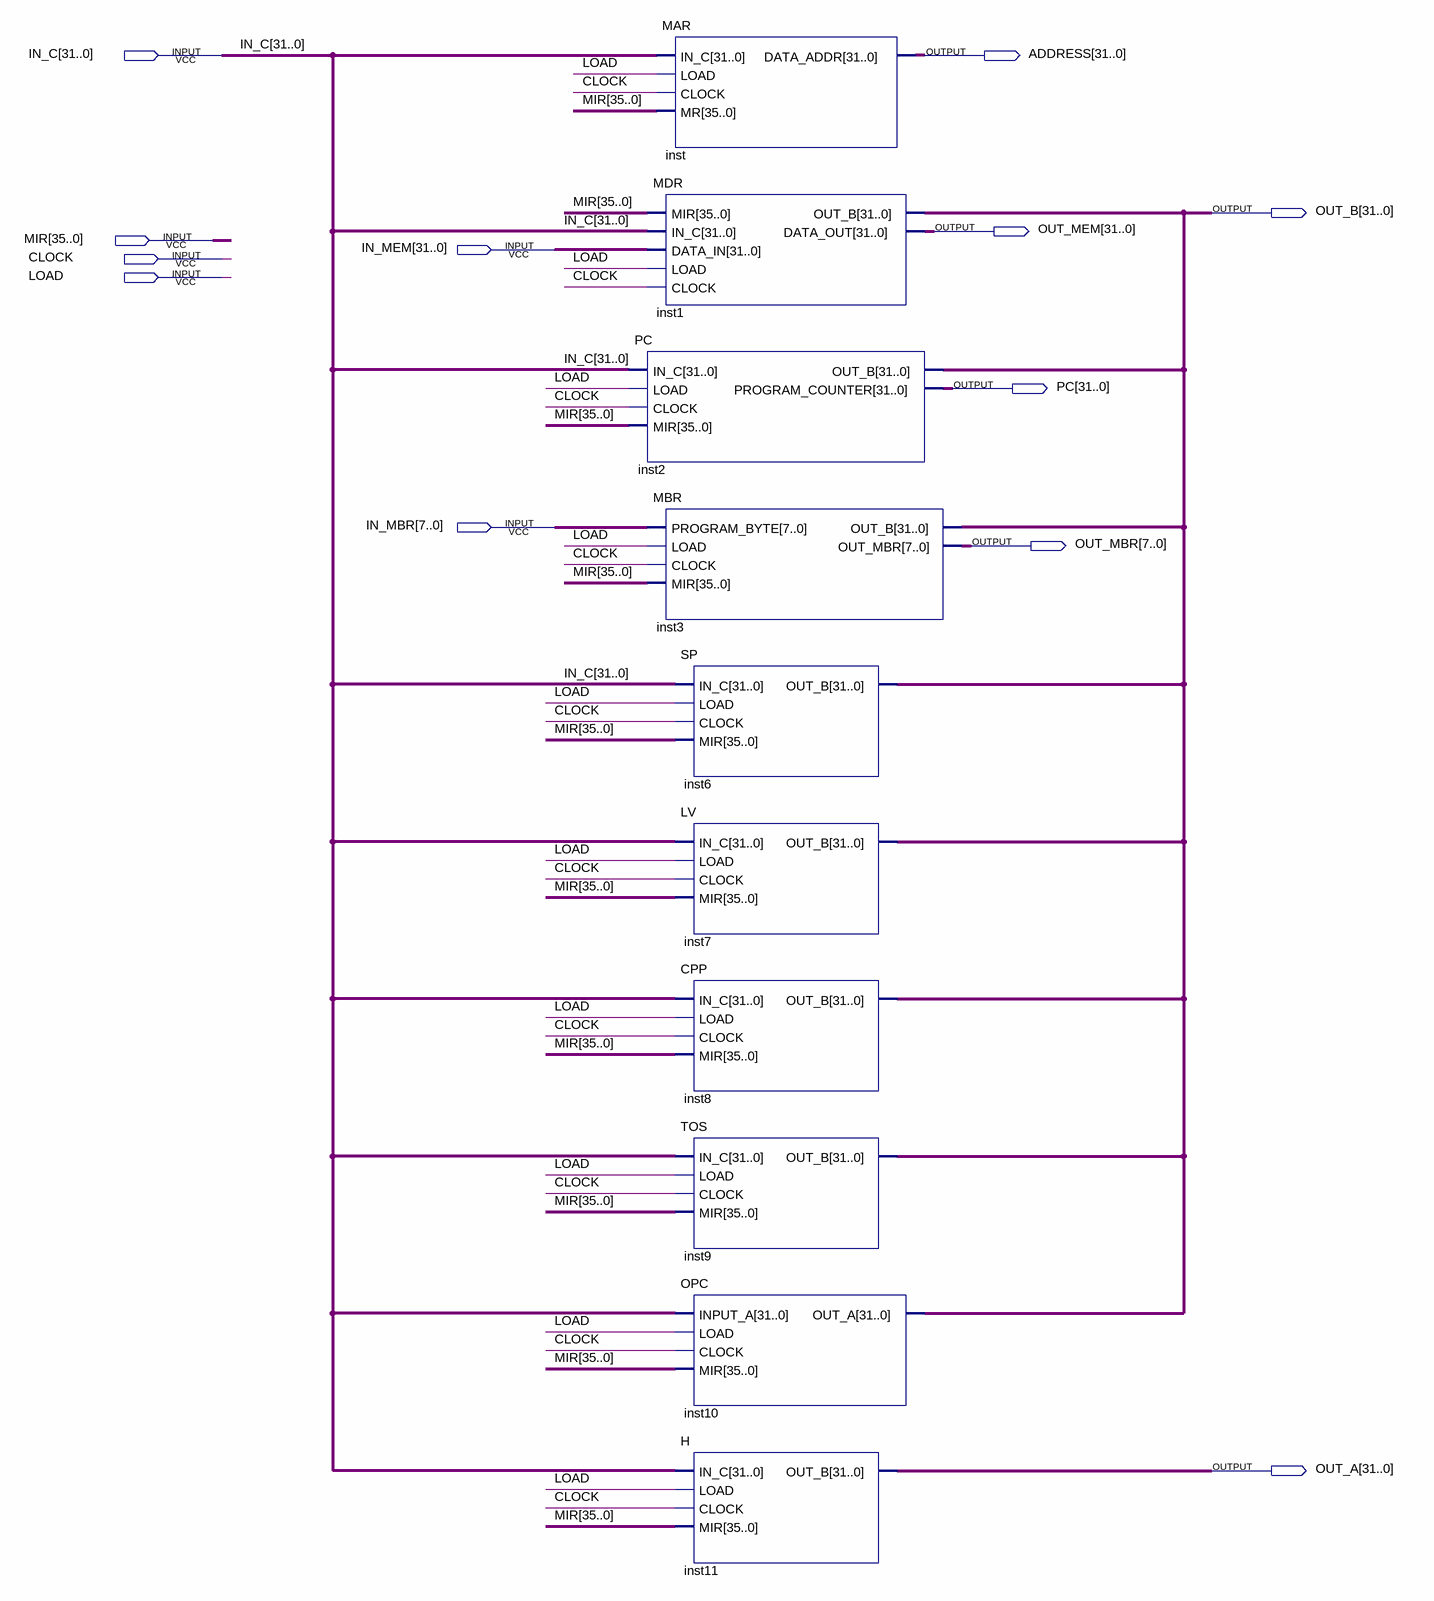
[diagram p0: schematic sheet]
// Quartus schematic BANK_REGS.bdf as structural Verilog: 10 symbols, 12 pins
module BANK_REGS (
  input  [31:0] IN_C,
  input  [35:0] MIR,
  input  [31:0] IN_MEM,
  input  CLOCK,
  input  LOAD,
  input  [7:0] IN_MBR,
  output [31:0] ADDRESS,
  output [31:0] OUT_B,
  output [31:0] OUT_MEM,
  output [31:0] PC,
  output [7:0] OUT_MBR,
  output [31:0] OUT_A
);

  MAR inst (.IN_C(IN_C), .LOAD(LOAD), .CLOCK(CLOCK), .MR(MIR), .DATA_ADDR(ADDRESS));
  MDR inst1 (.MIR(MIR), .IN_C(IN_C), .DATA_IN(IN_MEM), .LOAD(LOAD), .CLOCK(CLOCK), .OUT_B(OUT_B), .DATA_OUT(OUT_MEM));
  PC inst2 (.IN_C(IN_C), .LOAD(LOAD), .CLOCK(CLOCK), .MIR(MIR), .OUT_B(OUT_B), .PROGRAM_COUNTER(PC));
  MBR inst3 (.PROGRAM_BYTE(IN_MBR), .LOAD(LOAD), .CLOCK(CLOCK), .MIR(MIR), .OUT_B(OUT_B), .OUT_MBR(OUT_MBR));
  SP inst6 (.IN_C(IN_C), .LOAD(LOAD), .CLOCK(CLOCK), .MIR(MIR), .OUT_B(OUT_B));
  LV inst7 (.IN_C(IN_C), .LOAD(LOAD), .CLOCK(CLOCK), .MIR(MIR), .OUT_B(OUT_B));
  CPP inst8 (.IN_C(IN_C), .LOAD(LOAD), .CLOCK(CLOCK), .MIR(MIR), .OUT_B(OUT_B));
  TOS inst9 (.IN_C(IN_C), .LOAD(LOAD), .CLOCK(CLOCK), .MIR(MIR), .OUT_B(OUT_B));
  OPC inst10 (.INPUT_A(IN_C), .LOAD(LOAD), .CLOCK(CLOCK), .MIR(MIR), .OUT_A(OUT_B));
  H inst11 (.IN_C(IN_C), .LOAD(LOAD), .CLOCK(CLOCK), .MIR(MIR), .OUT_B(OUT_A));
endmodule
